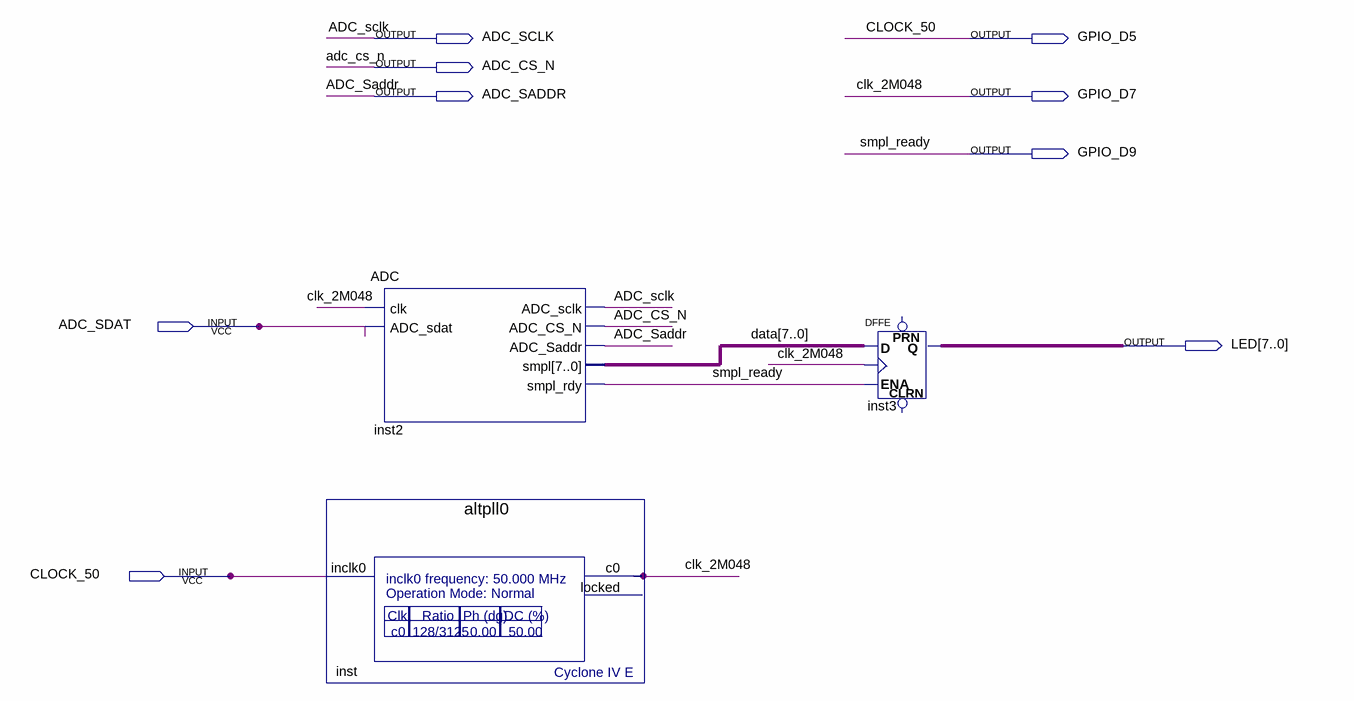
[diagram p0: schematic sheet]
// Quartus schematic main.bdf as structural Verilog: 3 symbols, 9 pins
module main (
  input  ADC_SDAT,
  input  CLOCK_50,
  output ADC_SCLK,
  output GPIO_D5,
  output ADC_CS_N,
  output ADC_SADDR,
  output GPIO_D7,
  output GPIO_D9,
  output [7:0] LED
);

  wire [7:0] data;

  ADC inst2 (
    .clk(GPIO_D7), .ADC_sdat(ADC_SDAT), .ADC_sclk(ADC_SCLK), .ADC_CS_N(ADC_CS_N), .ADC_Saddr(ADC_SADDR),
    .smpl(data), .smpl_rdy(GPIO_D9));
  altpll0 inst (.inclk0(CLOCK_50), .c0(GPIO_D7));  // open: locked
  DFFE inst3[7:0] (.D(data), .CLK(GPIO_D7), .ENA(GPIO_D9), .Q(LED));  // open: PRN, CLRN

  assign GPIO_D5 = CLOCK_50;

  // Other names for the same wires on the sheet: clk_2M048 = GPIO_D7; smpl_ready = GPIO_D9
endmodule
